# EAGLE design led_board_v2 (EAGLE 8.2.2)
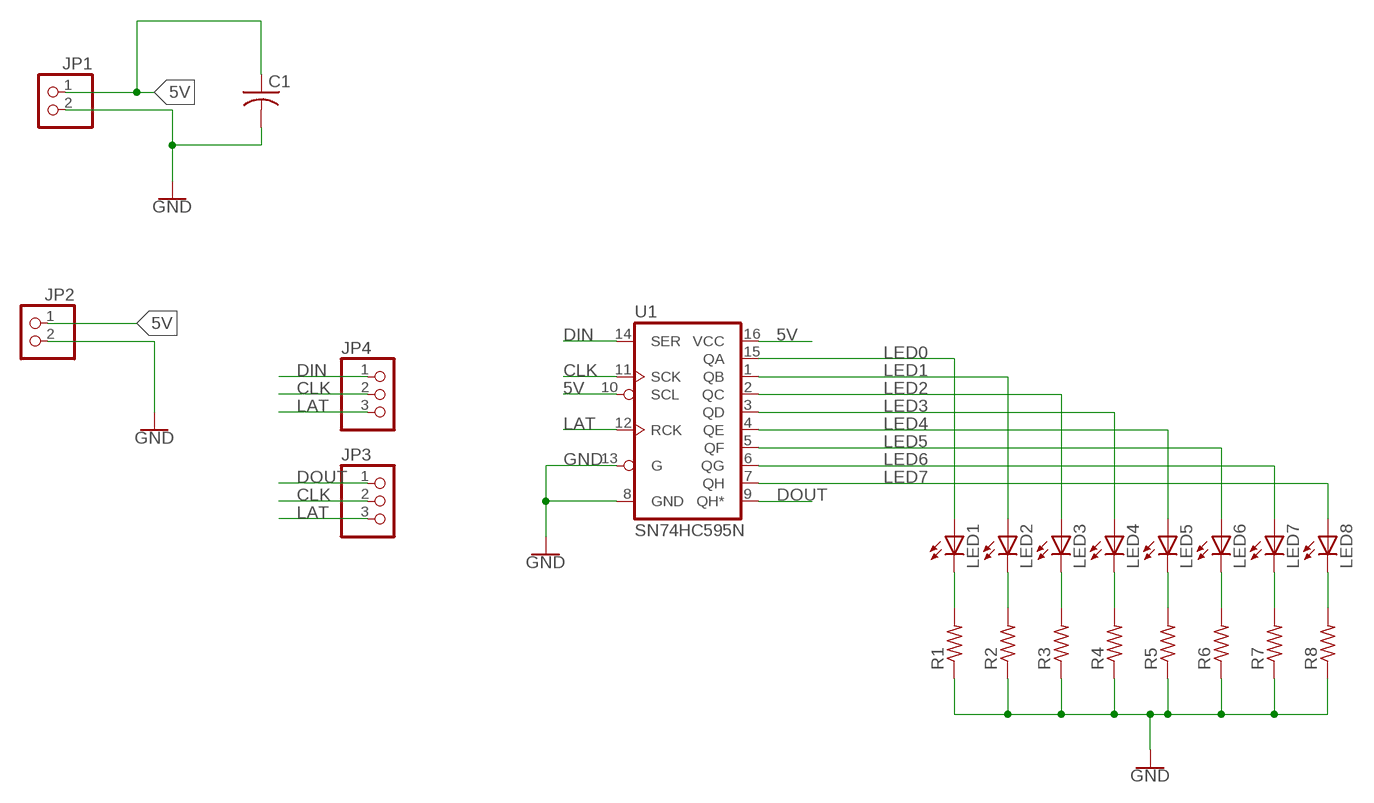
[diagram p0: schematic, sheet 1]

## Parts
C1  C-US025-030X050  [C025-030X050]
JP1  PINHD-1X2  [1X02]
JP2  PINHD-1X2  [1X02]
JP3  PINHD-1X3  [1X03]
JP4  PINHD-1X3  [1X03]
LED1  LED3MM  [LED3MM]
LED2  LED3MM  [LED3MM]
LED3  LED3MM  [LED3MM]
LED4  LED3MM  [LED3MM]
LED5  LED3MM  [LED3MM]
LED6  LED3MM  [LED3MM]
LED7  LED3MM  [LED3MM]
LED8  LED3MM  [LED3MM]
R1  R-US_0207/7  [0207/7]
R2  R-US_0207/7  [0207/7]
R3  R-US_0207/7  [0207/7]
R4  R-US_0207/7  [0207/7]
R5  R-US_0207/7  [0207/7]
R6  R-US_0207/7  [0207/7]
R7  R-US_0207/7  [0207/7]
R8  R-US_0207/7  [0207/7]
U1  SN74HC595N  74HC595N  [DIP16]

## Nets
5V: C1.1 JP1.1 JP2.1 U1.10(SCL) U1.16(VCC)
CLK: JP3.2 JP4.2 U1.11(SCK)
DIN: JP4.1 U1.14(SER)
DOUT: JP3.1 U1.9(QH*)
GND: C1.2 JP1.2 JP2.2 R1.1 R2.1 R3.1 R4.1 R5.1 R6.1 R7.1 R8.1 U1.8(GND) U1.13(G)
LAT: JP3.3 JP4.3 U1.12(RCK)
LED0: LED1.A U1.15(QA)
LED1: LED2.A U1.1(QB)
LED2: LED3.A U1.2(QC)
LED3: LED4.A U1.3(QD)
LED4: LED5.A U1.4(QE)
LED5: LED6.A U1.5(QF)
LED6: LED7.A U1.6(QG)
LED7: LED8.A U1.7(QH)
N$1: LED1.K(C) R1.2
N$2: LED2.K(C) R2.2
N$3: LED3.K(C) R3.2
N$4: LED4.K(C) R4.2
N$5: LED5.K(C) R5.2
N$6: LED6.K(C) R6.2
N$7: LED7.K(C) R7.2
N$8: LED8.K(C) R8.2

## Library data of the parts
C1 = adafruit:C-US: CAPACITOR, American symbol
JP1 JP2 = pinhead:PINHD-1X2: PIN HEADER
JP3 JP4 = pinhead:PINHD-1X3: PIN HEADER
LED1-LED8 = adafruit:LED: LED OSRAM: - CHIPLED LG R971, LG N971, LY N971, LG Q971, LY Q971, LO R971, LY R971 LH N974, LH R974 LS Q976, LO Q976, LY Q976 LO Q996 - Hyper CHIPLED LW Q18S LB Q993, LB Q99A, LB R99A - SideLED LS A670, LO A670, LY A670, LG A670, LP A670 LB A673, LV A673, LT A673, LW A673 LH A674 LY A675 LS A676, LA A676, LO A676, LY A676, LW A676 LS A679, LY A679, LG A679 - Hyper Micro SIDELED® LS Y876, LA Y876, LO Y876, LY Y876 LT Y87S - SmartLED LW L88C, LW L88S LB L89C, LB L89S, LG L890 LS L89K, LO L89K, LY L89K LS L896, LA L896, LO L896, LY L896 - TOPLED LS T670, LO T670, LY T670, LG T670, LP T670 LSG T670, LSP T670, LSY T670, LOP T670, LYG T670 LG T671, LOG T671, LSG T671 LB T673, LV T673, LT T673, LW T673 LH T674 LS T676, LA T676, LO T676, LY T676, LB T676, LH T676, LSB T676, LW T676 LB T67C, LV T67C, LT T67C, LS T67K, LO T67K, LY T67K, LW E67C LS E67B, LA E67B, LO E67B, LY E67B, LB E67C, LV E67C, LT E67C LW T67C LS T679, LY T679, LG T679 LS T770, LO T770, LY T770, LG T770, LP T770 LB T773, LV T773, LT T773, LW T773 LH T774 LS E675, LA E675, LY E675, LS T675 LS T776, LA T776, LO T776, LY T776, LB T776 LHGB T686 LT T68C, LB T68C - Hyper Mini TOPLED® LB M676 - Mini TOPLED Santana® LG M470 LS M47K, LO M47K, LY M47K Source: http://www.osram.convergy.de/
R1-R8 = adafruit:R-US_: RESISTOR, American symbol
U1 = SparkFun-IC-Logic:74*595: 8-Bit Shift Register (Serial to Parallel) Datasheet <http://cdn.sparkfun.com/datasheets/BreakoutBoards/MM74HC595.pdf> SparkFun Products SparkFun Shift Register Breakout - 74HC595 <https://www.sparkfun.com/products/10680> (BOB-10680); PROD_ID: IC-13123

## Board
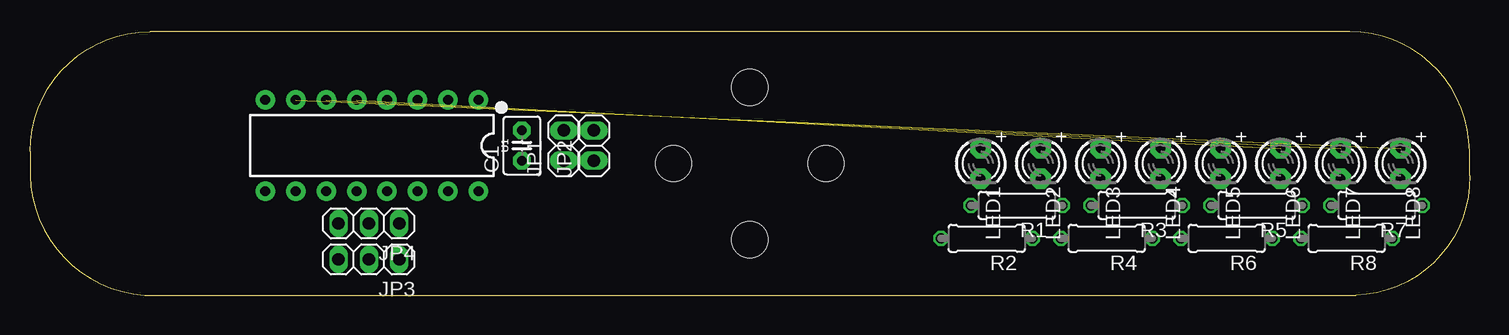
[diagram p1: board, top side]
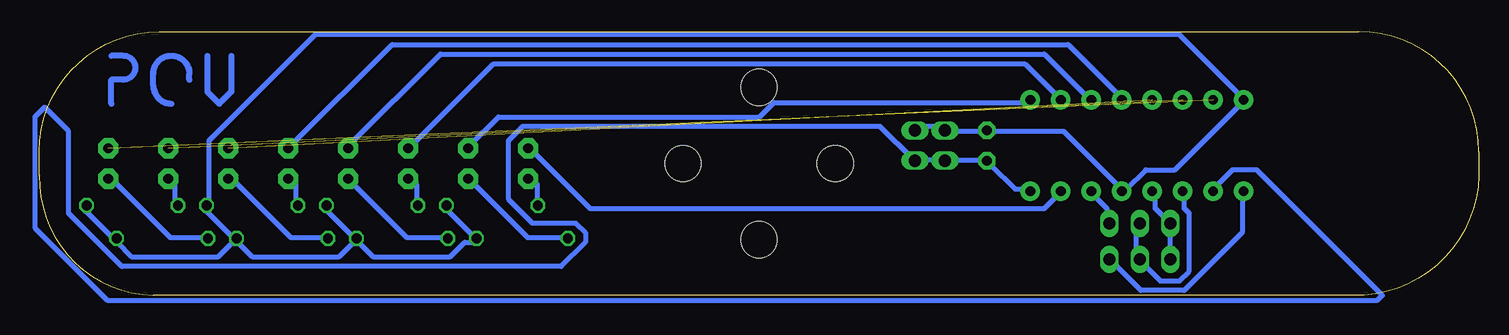
[diagram p2: board, bottom side, seen from below]

Size 120 x 22 mm. Coordinates in mm from the lower left corner, seen from the top.
Outline: 10.5,0 110.5,0 arc90 120,10 120,12 arc90 110,22 10,22 arc90 0,12 0,10 arc90 10.5,0
Copper layers (1*16): Top 0.035mm / dielectric 1.5mm / Bottom 0.035mm
Design rules "OthermillDRC_1_64_v2": minimum track width 16mil, minimum drill 31mil, track to track 0.39878125mm, track to pad 0.39878125mm, pad to pad 0.39878125mm, via to via 0.39878125mm, smd to smd 0mil, copper to edge 0mil, drill to drill 1mil, minimum pad ring 0mil, minimum via ring 15mil, stop-mask expansion 1mil, vias tented up to drill 30mil, thermal gap 10mil
Holes 3 mm at 60,4.65 60,17.35 66.35,11 53.65,11

### Footprints (pad centres in the part's own frame; a part is rotated, then mirrored left to right if it is on the bottom)
C025-030X050 = drill 0.813 pad 1.422 octagon: 1 -1.27,0; 2 1.27,0
1X02 = drill 1.016 long: 1 -1.27,0; 2 1.27,0
1X03 = drill 1.016 long: 1 -2.54,0; 2 0,0; 3 2.54,0
LED3MM = drill 0.813 pad 1.676 octagon: A -1.27,0; K 1.27,0
0207/7 = drill 0.813 octagon: 1 -3.81,0; 2 3.81,0
DIP16 = drill 0.813 pad 1.626: 1 -8.89,-3.81; 2 -6.35,-3.81; 3 -3.81,-3.81; 4 -1.27,-3.81; 5 1.27,-3.81; 6 3.81,-3.81; 7 6.35,-3.81; 8 8.89,-3.81; 9 8.89,3.81; 10 6.35,3.81; 11 3.81,3.81; 12 1.27,3.81; 13 -1.27,3.81; 14 -3.81,3.81; 15 -6.35,3.81; 16 -8.89,3.81

### Placement (x,y rotation side)
C1  41,12.5 90 top
JP1  44.5,12.5 90 top
JP2  47,12.5 90 top
JP3  28.25,3 180 top
JP4  28.25,6 180 top
LED1  79.25,11 270 top
LED2  84.25,11 270 top
LED3  89.25,11 270 top
LED4  94.25,11 270 top
LED5  99.25,11 270 top
LED6  104.25,11 270 top
LED7  109.25,11 270 top
LED8  114.25,11 270 top
R1  82.25,7.5 180 top
R2  79.75,4.75 180 top
R3  92.25,7.5 180 top
R4  89.75,4.75 180 top
R5  102.25,7.5 180 top
R6  99.75,4.75 180 top
R7  112.25,7.5 180 top
R8  109.75,4.75 180 top
U1  28.5,12.5 180 top

### Tracks (layer width: path | path; a pad name or v marks a point on that pad's centre or on a via)
5V
  Bottom 0.406: U1.10 22.14,8.86 20.53,10.47 18.52,10.47 8.05,0 8.45,-0.4 114.34,-0.4 120.38,5.64 120.38,14.9 119.57,15.7 117.56,13.69 117.56,6.84 113.13,2.42 76.49,2.42 74.48,4.43 74.48,5.23 75.28,6.04 78.91,6.04 80.92,8.05 80.92,12.88 79.71,14.09 49.92,14.09 47.1,11.27 JP2.1 46.7,11.27 44.69,11.27 JP1.1 44.28,11.27 41.06,11.27 C1.1 40.66,10.87 38.65,8.86 37.44,8.86 U1.16
CLK
  Bottom 0.406: JP4.2 28.58,5.64 28.58,3.22 JP3.2 28.18,2.82 26.57,1.21 24.96,1.21 24.16,2.01 24.16,6.84 24.56,7.25 24.56,8.45 U1.11
DIN
  Bottom 0.406: JP4.1 31,6.04 31,7.25 32.21,8.45 U1.14
DOUT
  Bottom 0.406: JP3.1 30.6,2.82 28.18,0.4 24.56,0.4 19.73,5.23 19.73,8.45 U1.9
GND
  Bottom 0.406: R1.1 86.15,7.25 83.74,4.83 R2.1 83.74,4.43 84.54,4.43 85.75,3.22 92.19,3.22 93.4,4.43 R4.1 | R4.1 93.8,4.83 96.22,7.25 R3.1 | R6.1 103.87,4.83 106.28,7.25 R5.1 105.88,7.65 105.88,12.88 97.02,21.74 24.96,21.74 19.73,16.51 U1.8 19.73,16.1 25.36,10.47 27.78,10.47 29.39,8.86 U1.13 29.79,8.86 34.62,13.69 40.66,13.69 C1.2 41.06,13.69 44.28,13.69 JP1.2 44.69,14.09 46.7,14.09 JP2.2 | R7.1 116.35,7.25 113.93,4.83 R8.1 113.53,4.43 112.32,3.22 105.08,3.22 103.87,4.43 R6.1 | R4.1 93.8,4.43 95.01,3.22 102.26,3.22 103.47,4.43 R6.1
LAT
  Bottom 0.406: JP3.3 25.77,3.22 25.77,5.64 JP4.3 25.77,6.04 26.97,7.25 26.97,8.45 U1.12
LED0
  Bottom 0.406: U1.15 35.02,8.45 36.23,7.25 74.08,7.25 78.91,12.08 LED1.A
LED1
  Bottom 0.406: U1.1 37.44,16.1 58.78,16.1 59.99,14.9 81.73,14.9 84.14,12.48 LED2.A
LED2
  Bottom 0.406: U1.2 35.02,16.51 37.84,19.32 82.13,19.32 88.97,12.48 LED3.A
LED3
  Bottom 0.406: U1.3 32.61,16.51 36.23,20.13 86.56,20.13 94.21,12.48 LED4.A
LED4
  Bottom 0.406: U1.4 29.79,16.51 34.22,20.93 90.58,20.93 99.04,12.48 LED5.A
LED5  (1 unrouted)
LED6  (1 unrouted)
LED7  (1 unrouted)
N$1
  Bottom 0.406: R1.2 78.5,7.65 78.5,9.26 78.91,9.66 LED1.K
N$2
  Bottom 0.406: R2.2 76.09,4.83 79.31,4.83 84.14,9.66 LED2.K
N$3
  Bottom 0.406: R3.2 88.57,7.65 88.57,9.26 88.97,9.66 LED3.K
N$4
  Bottom 0.406: R4.2 86.15,4.83 89.38,4.83 94.21,9.66 LED4.K
N$5
  Bottom 0.406: R5.2 98.64,7.65 98.64,9.26 99.04,9.66 LED5.K
N$6
  Bottom 0.406: R6.2 96.22,4.83 99.04,4.83 103.87,9.66 LED6.K
N$7
  Bottom 0.406: R7.2 108.7,7.65 108.7,9.26 109.1,9.66 LED7.K
N$8
  Bottom 0.406: R8.2 106.28,4.83 109.1,4.83 113.93,9.66 LED8.K
O
  Bottom 0.508: 107.5,18 107.5,18.5 arc-90 109,20 arc-90 110.5,18.5 110.5,17.5 arc-90 109,16
P
  Bottom 0.508: 114,16 114,18 113,18 arc-90 112,19 arc-90 113,20 114,20
V
  Bottom 0.508: 106,20 106,17 105,16 104,17 104,20